# Altium project Lenobitech.PrjPcb
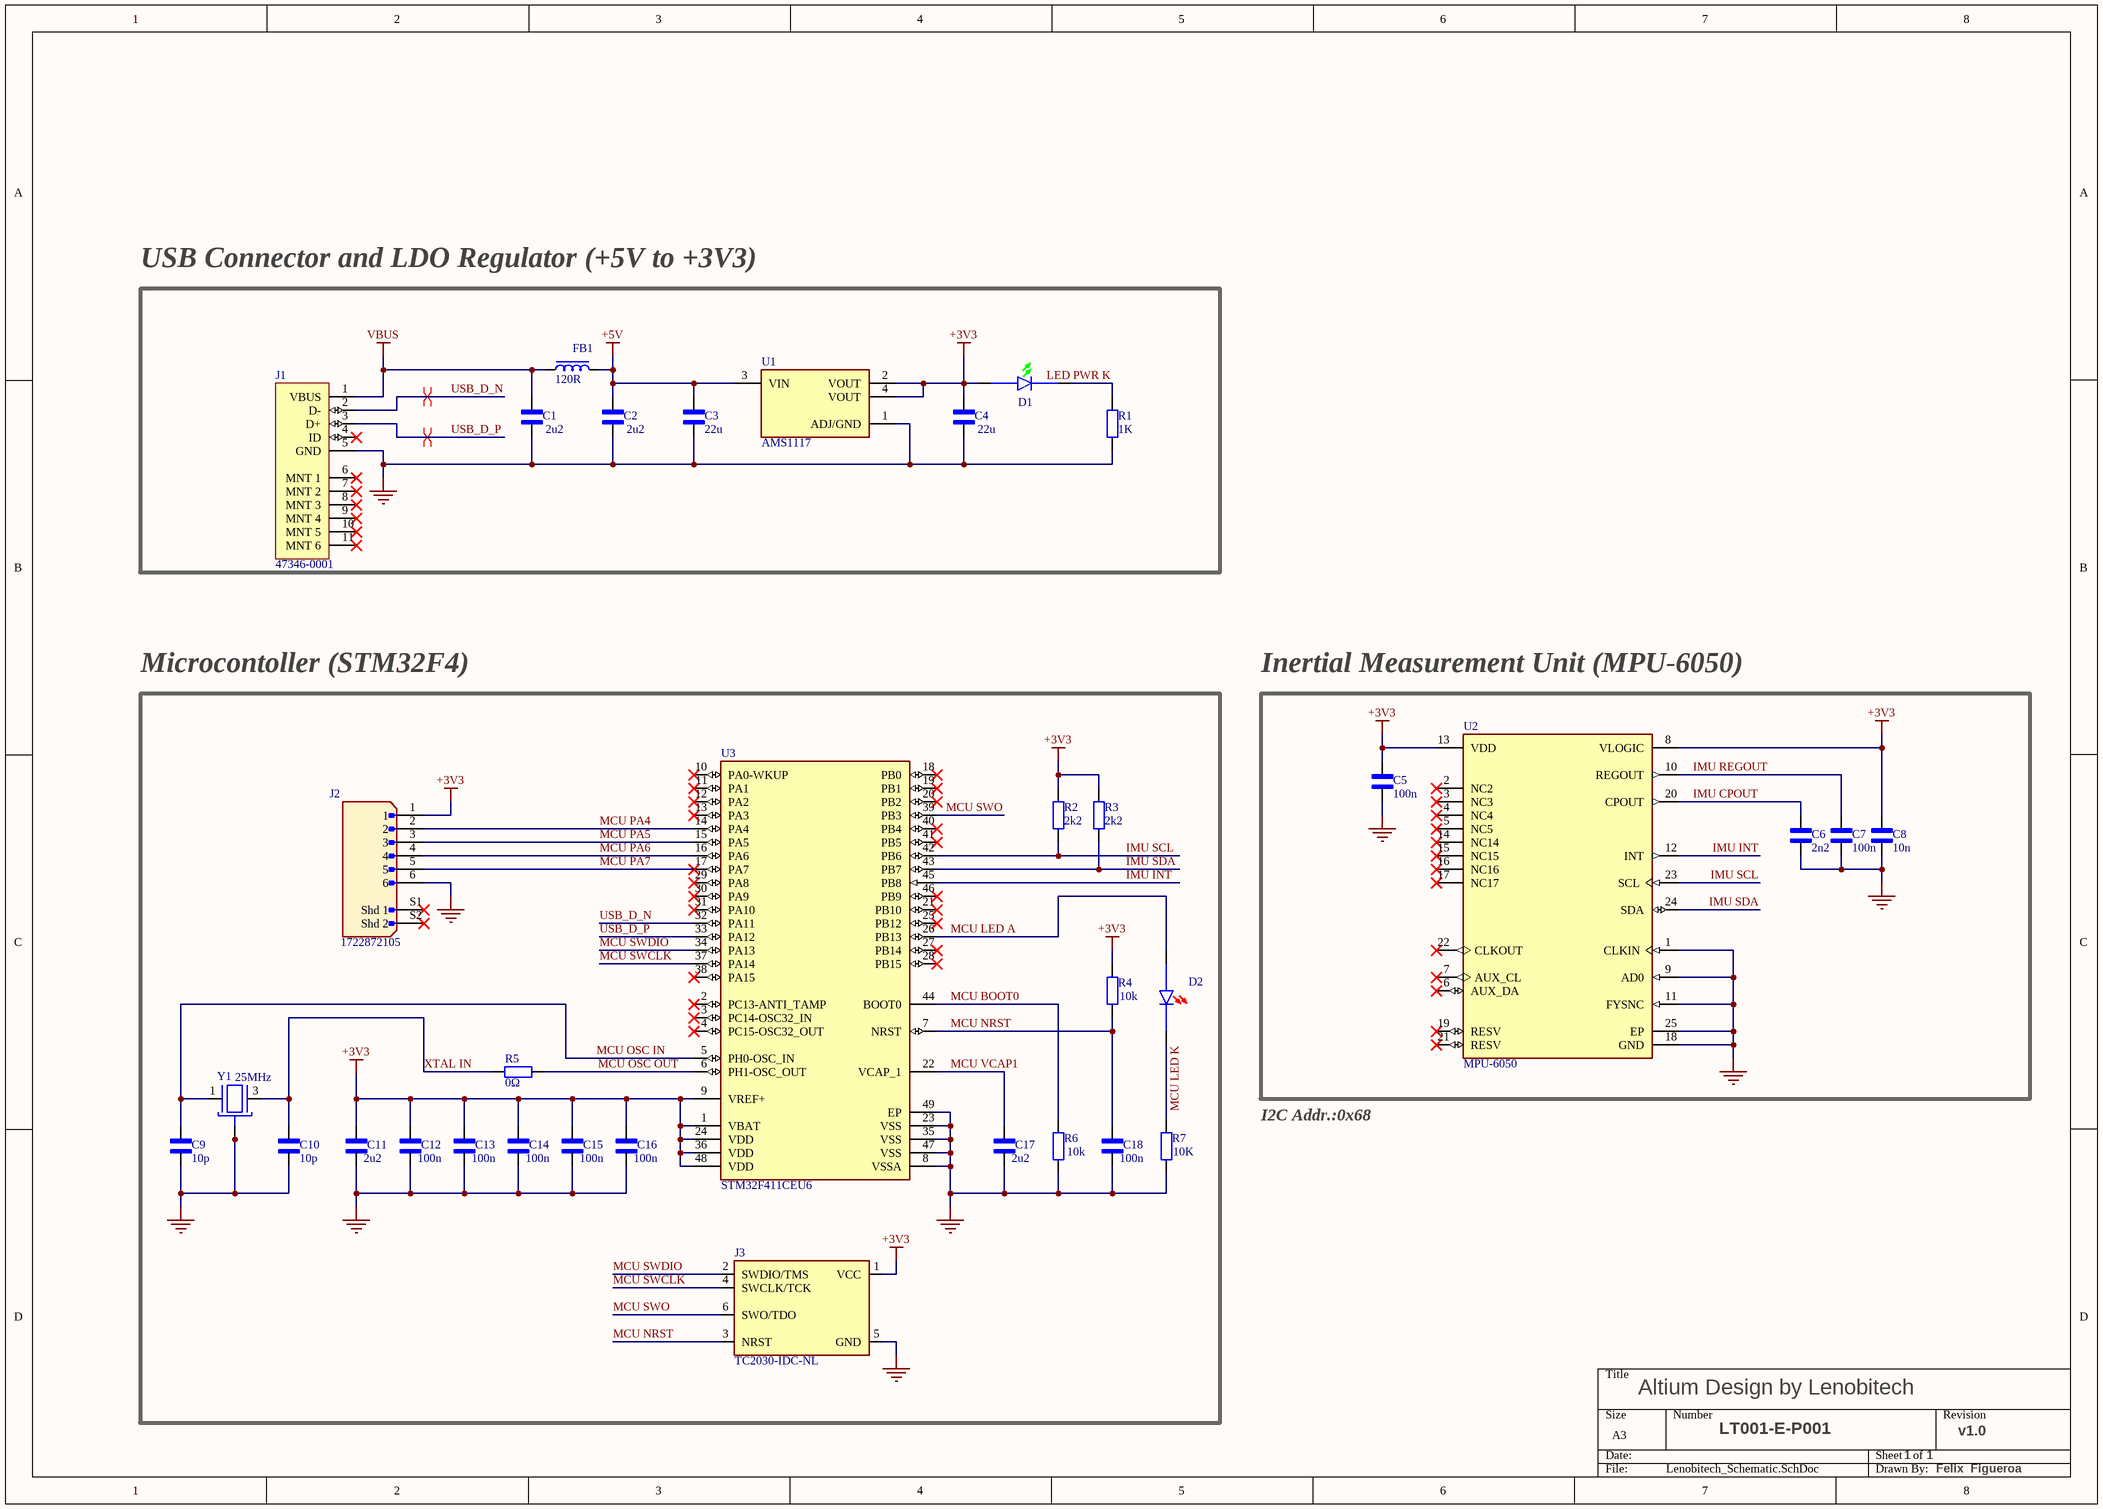
[diagram p0: Lenobitech_Schematic.SchDoc]
1 sheet, 35 parts. Net scope: global (net labels, ports and power ports of the same name join across sheets).
Board file: PCB1.PcbDoc

## Sheet Lenobitech_Schematic.SchDoc
size A3; SheetNumber: 1; SheetTotal: 1; SPICEModelCacheAJFZGDHM: <root> / <DocumentId>AJFZGDHM</DocumentId> / </root>

### Parts
C1  value 2u2  [CAPC1608X90N]  (hidden comment: CAP_0603)
C2  value 2u2  [CAPC1608X90N]  (hidden comment: CAP_0603)
C3  value 22u  [CAPC2012X145N]  (hidden comment: CAP_0805_16V)
C4  value 22u  [CAPC2012X145N]  (hidden comment: CAP_0603)
C5  value 100n  [CAPC1005X55N]  (hidden comment: CAP_0402)
C6  value 2n2  [CAPC1005X55N]  (hidden comment: CAP_0402)
C7  value 100n  [CAPC1005X55N]  (hidden comment: CAP_0402)
C8  value 10n  [CAPC1005X55N]  (hidden comment: CAP_0402)
C9  value 10p  [CAPC1005X55N]  (hidden comment: CAP_0402_16V)
C10  value 10p  [CAPC1005X55N]  (hidden comment: CAP_0402_16V)
C11  value 2u2  [CAPC1608X90N]  (hidden comment: CAP_0603)
C12  value 100n  [CAPC1005X55N]  (hidden comment: CAP_0402)
C13  value 100n  [CAPC1005X55N]  (hidden comment: CAP_0402)
C14  value 100n  [CAPC1005X55N]  (hidden comment: CAP_0402)
C15  value 100n  [CAPC1005X55N]  (hidden comment: CAP_0402)
C16  value 100n  [CAPC1005X55N]  (hidden comment: CAP_0402)
C17  value 2u2  [CAPC1608X90N]  (hidden comment: CAP_0603)
C18  value 100n  [CAPC1005X55N]  (hidden comment: CAP_0402)
D1  HSMS-C190  [LEDM1608X80]  (value not drawn)
D2  HSMS-C190_1  [LEDM1608X80]  (value not drawn)
FB1  120R  [BEADC1608X75N]
J1  47346-0001  [MOLEX_47346-0001]
J2  1722872105  [JST_SM06B-SRSS-TB(LF)(SN)]
J3  TC2030-IDC-NL  [TAG_TC2030-IDC-NL]
R1  value 1K  [RESC1005X37N]  (hidden comment: RES_0402)
R2  value 2k2  [RESC1005X37N]  (hidden comment: RES_0402)
R3  value 2k2  [RESC1005X37N]  (hidden comment: RES_0402)
R4  value 10k  [RESC1005X37N]  (hidden comment: RES_0402)
R5  value 0Ω  [RESC1005X37N]  (hidden comment: RES_0402)
R6  value 10k  [RESC1005X37N]  (hidden comment: RES_0402)
R7  value 10K  [RESC1005X37N]  (hidden comment: RES_0402)
U1  AMS1117  [SOT229P700X180-4N]
U2  MPU-6050  [IC_MPU6050]
U3  STM32F411CEU6  [QFN50P700X700X60-49N]
Y1  value 25MHz  [OSC_ABM3B-25.000MHZ-10-1-U-T]  (hidden comment: ABM3B-25.000MHZ-10-1-U-T)

### Blocks framed on the sheet
USB Connector and LDO Regulator (+5V to +3V3): C1-C4 D1 FB1 J1 R1 U1
Microcontoller (STM32F4): C9-C18 D2 J2 J3 R2-R7 U3 Y1
Inertial Measurement Unit (MPU-6050): C5-C8 U2

### Nets
+3V3: C4.2 C5.2 C8.1 C11.2 C12.2 C13.2 C14.2 C15.2 C16.2 D1.A J2.1 J3.1(VCC) R2.2 R3.2 R4.2 U1.2(VOUT) U1.4(VOUT) U2.8(VLOGIC) U2.13(VDD) U3.1(VBAT) U3.9(VREF+) U3.24(VDD) U3.36(VDD) U3.48(VDD)
+5V: C2.2 C3.2 FB1.2 U1.3(VIN)
GND: C1.1 C2.1 C3.1 C4.1 C5.1 C6.2 C7.2 C8.2 C9.1 C10.1 C11.1 C12.1 C13.1 C14.1 C15.1 C16.1 C17.1 C18.1 J1.5(GND) J2.6 J3.5(GND) R1.1 R6.1 R7.2 U1.1(ADJ/GND) U2.1(CLKIN) U2.9(AD0) U2.11(FYSNC) U2.18(GND) U2.25(EP) U3.8(VSSA) U3.23(VSS) U3.35(VSS) U3.47(VSS) U3.49(EP) Y1.2(GND) Y1.4(GND)
VBUS: C1.2 FB1.1 J1.1(VBUS)
IMU CPOUT: C6.1 U2.20(CPOUT)
IMU INT: U2.12(INT) U3.45(PB8)
IMU REGOUT: C7.1 U2.10(REGOUT)
IMU SCL: R2.1 U2.23(SCL) U3.42(PB6)
IMU SDA: R3.1 U2.24(SDA) U3.43(PB7)
LED PWR K: D1.K R1.2
MCU BOOT0: R6.2 U3.44(BOOT0)
MCU LED A: D2.A U3.26(PB13)
MCU LED K: D2.K R7.1
MCU NRST: C18.2 J3.3(NRST) R4.1 U3.7(NRST)
MCU OSC IN: C9.2 U3.5(PH0-OSC_IN) Y1.1
MCU OSC OUT: R5.1 U3.6(PH1-OSC_OUT)
MCU PA4: J2.2 U3.14(PA4)
MCU PA5: J2.3 U3.15(PA5)
MCU PA6: J2.4 U3.16(PA6)
MCU PA7: J2.5 U3.17(PA7)
MCU SWCLK: J3.4(SWCLK/TCK) U3.37(PA14)
MCU SWDIO: J3.2(SWDIO/TMS) U3.34(PA13)
MCU SWO: J3.6(SWO/TDO) U3.39(PB3)
MCU VCAP1: C17.2 U3.22(VCAP_1)
USB_D_N: J1.2(D-) U3.32(PA11)
USB_D_P: J1.3(D+) U3.33(PA12)
XTAL IN: C10.2 R5.2 Y1.3

Not connected (* = marked no-connect by the designer): J1 4(ID)* 6(MNT_1)* 7(MNT_2)* 8(MNT_3)* 9(MNT_4)* 10(MNT_5)* 11(MNT_6)*; J2 S1(Shd_1)* S2(Shd_2)*; U2 2(NC2)* 3(NC3)* 4(NC4)* 5(NC5)* 6(AUX_DA)* 7(AUX_CL)* 14(NC14)* 15(NC15)* 16(NC16)* 17(NC17)* 19(RESV)* 21(RESV)* 22(CLKOUT)*; U3 2(PC13-ANTI_TAMP)* 3(PC14-OSC32_IN)* 4(PC15-OSC32_OUT)* 10(PA0-WKUP)* 11(PA1)* 12(PA2)* 13(PA3)* 18(PB0)* 19(PB1)* 20(PB2)* 21(PB10)* 25(PB12)* 27(PB14)* 28(PB15)* 29(PA8)* 30(PA9)* 31(PA10)* 38(PA15)* 40(PB4)* 41(PB5)* 46(PB9)*

### Layout directives
differential pair: USB_D_N, USB_D_P

### Notes on the sheet
- I2C Addr.:0x68
- Altium Design by Lenobitech
- LT001-E-P001
- 1
- v1.0
- Felix  Figueroa

### Library data of the parts
C1 C11 C17 = C0603_16V: C0603C225K4PACTU / 2.2ÂµF Â±10% 16V Ceramic Capacitor X5R 0603 _1608 Metric_; MF: KEMET; SnapEDA_Link: https://www.snapeda.com/parts/C0603C225K4PACTU/KEMET/view-part/609526/?ref=snap; Availability: Unavailable; Price: None; MP: C0603C225K4PACTU; Package: 0603 KEMET
C2 = CAP_0603_16V: C0603C225K4PACTU / 2.2ÂµF Â±10% 16V Ceramic Capacitor X5R 0603 _1608 Metric_; MF: KEMET; SnapEDA_Link: https://www.snapeda.com/parts/C0603C225K4PACTU/KEMET/view-part/609526/?ref=snap; Availability: Unavailable; Price: None; MP: C0603C225K4PACTU; Package: 0603 KEMET
C3 C4 = CAP_0805_16V: C0805C226M8PAC7800 / 22ÂµF Â±20% 16V Ceramic Capacitor X5R 0805 _2012 Metric_; MF: KEMET; SnapEDA_Link: https://www.snapeda.com/parts/C0805C226M8PAC7800/KEMET/view-part/3932518/?ref=snap; Package: 2012 KEMET; MP: C0805C226M8PAC7800; Digi-Key_Part_Number: 399-12069-1-ND; Digi-Key_Purchase_URL: https://www.digikey.com/product-detail/en/kemet/C0805C226M8PAC7800/399-12069-1-ND/5327671?utm_source=snapeda&utm_medium=aggregator&utm_campaign=symbol
C5-C10 = CAP_0402_16V: C0402C104K4RAC7411_KEMET / 0.1ÂµF Â±10% 16V Ceramic Capacitor X7R 0402 (1005 Metric); MF: KEMET; MP: C0402C104K4RAC7411; SnapEDA_Link: https://www.snapeda.com/parts/C0402C104K4RAC7411/KEMET/view-part/3213918/?ref=snap; Package: 1005 KEMET; Digi-Key_Part_Number: 399-C0402C104K4RAC7411CT-ND
C12-C16 C18 = C0402_16V: C0402C104K4RAC7411_KEMET / 0.1ÂµF Â±10% 16V Ceramic Capacitor X7R 0402 (1005 Metric); MF: KEMET; MP: C0402C104K4RAC7411; SnapEDA_Link: https://www.snapeda.com/parts/C0402C104K4RAC7411/KEMET/view-part/3213918/?ref=snap; Package: 1005 KEMET; Digi-Key_Part_Number: 399-C0402C104K4RAC7411CT-ND
D1 = HSMS-C190: Red 626nm LED Indication - Discrete 2.1V 0603 _1608 Metric_; MF: Broadcom Limited; MP: HSMS-C190; Package: 0603 Broadcom; Price: None; Availability: Unavailable; SnapEDA_Link: https://www.snapeda.com/parts/HSMS-C190/Broadcom%20Limited/view-part/1781258/?ref=snap
D2 = HSMS-C190_RD: Red 626nm LED Indication - Discrete 2.1V 0603 _1608 Metric_; MF: Broadcom Limited; MP: HSMS-C190; Package: 0603 Broadcom; Price: None; Availability: Unavailable; SnapEDA_Link: https://www.snapeda.com/parts/HSMS-C190/Broadcom%20Limited/view-part/1781258/?ref=snap
FB1 = BLM18KG102WH1D: 1 kOhms @ 100MHz 1 GÃ¼Ã§ HattÄ± Ferrit Boncuk 0603 (1608 Metrik) 800mA 230mOhm; MF: Murata; Price: None; Package: 0603 Murata; Purchase-URL: https://pricing.snapeda.com/search/part/BLM18KG102WH1D/?ref=eda; MP: BLM18KG102WH1D; Availability: Good; SnapEDA_Link: https://www.snapeda.com/parts/BLM18KG102WH1D/Murata/view-part/4970268/?ref=snap; Check_prices: https://www.snapeda.com/parts/BLM18KG102WH1D/Murata/view-part/4970268/?ref=eda; Value: *
J1 = 47346-0001: USB Connectors MICRO USB B RECPT BTTM MOUNT ASSY; MF: Molex; Package: None; MP: 47346-0001; Purchase-URL: https://pricing.snapeda.com/search/part/47346-0001/?ref=eda; Check_prices: https://www.snapeda.com/parts/47346-0001/Molex/view-part/53503/?ref=eda; Value: *; Availability: Warning; Price: None; SnapEDA_Link: https://www.snapeda.com/parts/47346-0001/Molex/view-part/53503/?ref=snap
J2 = SM06B-SRSS-TB: Connector Header Surface Mount, Right Angle 6 position 0.039" (1.00mm); Value: *; Availability: Unavailable; Package: None; MP: 1722872105; Price: None
J3 = TC2030-IDC-NL: CABLE ADAPTER 6 POS; Value: *; MP: TC2030-IDC-NL; Availability: Unavailable; Package: None; Price: None
R1-R7 = RES_0402: AC0402 10K 5% 0,063W AUTOMO; MP: AC0402JR-0710KL; Package: None; Price: None; Availability: Unavailable
U1 = AMS1117: Sot223/Pkg 1-Amp 5-Volt Low Drop Out Voltage Regulatator; Value: *; Availability: Unavailable; Price: None; MP: AMS1117; Package: None
U2 = MPU6050: Is the worldâ€™s first integrated 6-axis MotionTracking device that combines a 3-axis gyroscope, 3-axis accelerometer, and a Digital Motion Processorâ„¢ (DMP) all in a small 4x4x0.9mm Package.; Package: None; Availability: Unavailable; Value: *; MP: MPU6050; Price: None
U3 = STM32F411CEU6: ARMÂ® CortexÂ®-M4 STM32F4 Microcontroller IC 32-Bit 100MHz 512KB (512K x 8) FLASH 48-UFQFPN (7x7); MF: STMicroelectronics; Price: None; MP: STM32F411CEU6; DigiKey-Purchase-URL: https://snapeda.com/shop?store=DigiKey&id=383021; Package: UFQFN-48 STMicroelectronics; Mouser-Purchase-URL: https://snapeda.com/shop?store=Mouser&id=383021; SnapEDA_Link: https://www.snapeda.com/parts/STM32F411CEU6/STMicroelectronics/view-part/383021/?ref=snap; Availability: Good; Value: *
Y1 = ABM3B-25.000MHZ-10-1-U-T: 25 MHz Â±10ppm Crystal 10pF 50 Ohms 4-SMD, No Lead; MF: Abracon; Check_prices: https://www.snapeda.com/parts/ABM3B-25.000MHZ-10-1-U-T/Abracon+LLC/view-part/?ref=eda; SnapEDA_Link: https://www.snapeda.com/parts/ABM3B-25.000MHZ-10-1-U-T/Abracon+LLC/view-part/?ref=snap; Availability: In Stock; MP: ABM3B-25.000MHZ-10-1-U-T; Purchase-URL: https://pricing.snapeda.com/search/part/ABM3B-25.000MHZ-10-1-U-T/?ref=eda; Package: SMD-4 Abracon LLC; Price: None